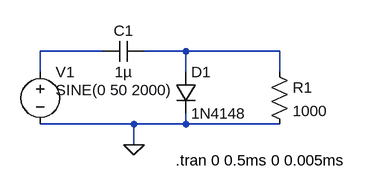
[diagram p0: schematic Clamper.asc]
Clamper.asc, the LTspice schematic file:
Version 4
SHEET 1 880 680
WIRE 64 112 -32 112
WIRE 192 112 128 112
WIRE 336 112 192 112
WIRE -32 144 -32 112
WIRE 192 144 192 112
WIRE 336 144 336 112
WIRE 112 224 -32 224
WIRE 192 224 192 208
WIRE 192 224 112 224
WIRE 336 224 192 224
WIRE 112 256 112 224
FLAG 112 256 0
SYMBOL cap 128 96 R90
WINDOW 0 0 32 VBottom 2
WINDOW 3 32 32 VTop 2
SYMATTR InstName C1
SYMATTR Value 1µ
SYMBOL diode 176 144 R0
SYMATTR InstName D1
SYMATTR Value 1N4148
SYMBOL res 320 128 R0
SYMATTR InstName R1
SYMATTR Value 1000
SYMBOL voltage -32 128 R0
WINDOW 3 24 44 Left 2
WINDOW 123 0 0 Left 0
WINDOW 39 0 0 Left 0
SYMATTR InstName V1
SYMATTR Value SINE(0 50 2000)
TEXT 176 280 Left 2 !.tran 0 0.5ms 0 0.005ms

The netlist it stands for:
* Clamper.asc
C1 N002 N001 1µ
D1 N002 0 1N4148
R1 N002 0 1000
V1 N001 0 SINE(0 50 2000)
.model D D
.lib standard.dio
.tran 0 0.5ms 0 0.005ms
.backanno
.end